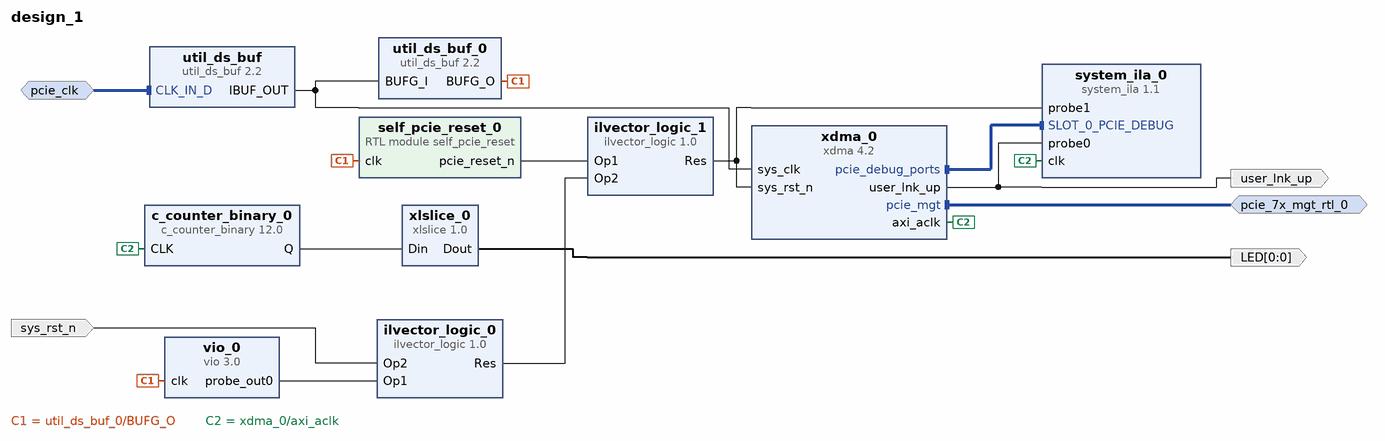
[diagram p0: block diagram of the top level]
# Vivado block design design_1, xc7a200tfbg484-2, Vivado 2025.2
create_bd_design design_1

create_bd_intf_port -mode Master -vlnv xilinx.com:interface:pcie_7x_mgt_rtl:1.0 pcie_7x_mgt_rtl_0
create_bd_intf_port -mode Slave -vlnv xilinx.com:interface:diff_clock_rtl:1.0 pcie_clk
set_property -dict {CONFIG.FREQ_HZ 100000000} [get_bd_intf_ports pcie_clk]
create_bd_port -dir I -type rst sys_rst_n
set_property -dict {CONFIG.POLARITY ACTIVE_LOW} [get_bd_ports sys_rst_n]
create_bd_port -dir O -from 0 -to 0 LED
create_bd_port -dir O user_lnk_up

create_bd_cell -type ip -vlnv xilinx.com:ip:xdma:4.2 xdma_0
set_property -dict [list \
  CONFIG.axi_data_width 64_bit \
  CONFIG.axilite_master_en false \
  CONFIG.axisten_freq 125 \
  CONFIG.enable_ltssm_dbg true \
  CONFIG.enable_mark_debug true \
  CONFIG.enable_pcie_debug_ports True \
  CONFIG.mode_selection Advanced \
  CONFIG.pcie_blk_locn X0Y0 \
  CONFIG.pf0_device_id 7022 \
  CONFIG.pl_link_cap_max_link_speed 5.0_GT/s \
  CONFIG.pl_link_cap_max_link_width X2 \
  CONFIG.ref_clk_freq 100_MHz \
  CONFIG.vendor_id 10EE \
  CONFIG.xdma_axi_intf_mm AXI_Memory_Mapped \
  CONFIG.xdma_num_usr_irq 1 \
  CONFIG.xdma_rnum_chnl 1 \
  CONFIG.xdma_wnum_chnl 1 \
] [get_bd_cells xdma_0]
create_bd_cell -type ip -vlnv xilinx.com:ip:util_ds_buf:2.2 util_ds_buf
set_property -dict {CONFIG.C_BUF_TYPE IBUFDSGTE} [get_bd_cells util_ds_buf]
create_bd_cell -type ip -vlnv xilinx.com:ip:c_counter_binary:12.0 c_counter_binary_0
set_property -dict {CONFIG.Output_Width 26} [get_bd_cells c_counter_binary_0]
create_bd_cell -type ip -vlnv xilinx.com:ip:xlslice:1.0 xlslice_0
set_property -dict {CONFIG.DIN_FROM 25 CONFIG.DIN_TO 25 CONFIG.DIN_WIDTH 26} [get_bd_cells xlslice_0]
create_bd_cell -type ip -vlnv xilinx.com:ip:system_ila:1.1 system_ila_0
set_property -dict [list \
  CONFIG.ALL_PROBE_SAME_MU_CNT 1 \
  CONFIG.C_DATA_DEPTH 8192 \
  CONFIG.C_MON_TYPE MIX \
  CONFIG.C_NUM_MONITOR_SLOTS 1 \
  CONFIG.C_NUM_OF_PROBES 2 \
  CONFIG.C_PROBE_WIDTH_PROPAGATION AUTO \
  CONFIG.C_SLOT_0_INTF_TYPE xilinx.com:display_xdma:pcie_debug_rtl:1.0 \
] [get_bd_cells system_ila_0]
create_bd_cell -type ip -vlnv xilinx.com:ip:vio:3.0 vio_0
set_property -dict {CONFIG.C_NUM_PROBE_IN 0 CONFIG.C_PROBE_OUT0_INIT_VAL 0001} [get_bd_cells vio_0]
create_bd_cell -type inline_hdl -vlnv xilinx.com:inline_hdl:ilvector_logic:1.0 ilvector_logic_0
set_property -dict {CONFIG.C_SIZE 1} [get_bd_cells ilvector_logic_0]
create_bd_cell -type ip -vlnv xilinx.com:ip:util_ds_buf:2.2 util_ds_buf_0
set_property -dict {CONFIG.C_BUF_TYPE BUFG} [get_bd_cells util_ds_buf_0]
create_bd_cell -type module -reference self_pcie_reset self_pcie_reset_0
create_bd_cell -type inline_hdl -vlnv xilinx.com:inline_hdl:ilvector_logic:1.0 ilvector_logic_1
set_property -dict {CONFIG.C_SIZE 1} [get_bd_cells ilvector_logic_1]

# ---- connections ----

connect_bd_intf_net [get_bd_intf_pins xdma_0/pcie_debug_ports] [get_bd_intf_pins system_ila_0/SLOT_0_PCIE_DEBUG]
connect_bd_intf_net [get_bd_intf_ports pcie_clk] [get_bd_intf_pins util_ds_buf/CLK_IN_D]
connect_bd_intf_net [get_bd_intf_ports pcie_7x_mgt_rtl_0] [get_bd_intf_pins xdma_0/pcie_mgt]
connect_bd_net [get_bd_pins c_counter_binary_0/Q] [get_bd_pins xlslice_0/Din]
connect_bd_net -net ilvector_logic_0_Res [get_bd_pins ilvector_logic_1/Res] [get_bd_pins xdma_0/sys_rst_n] [get_bd_pins system_ila_0/probe1]
connect_bd_net [get_bd_pins ilvector_logic_0/Res] [get_bd_pins ilvector_logic_1/Op2]
connect_bd_net [get_bd_pins self_pcie_reset_0/pcie_reset_n] [get_bd_pins ilvector_logic_1/Op1]
connect_bd_net [get_bd_ports sys_rst_n] [get_bd_pins ilvector_logic_0/Op2]
connect_bd_net [get_bd_pins util_ds_buf_0/BUFG_O] [get_bd_pins vio_0/clk] [get_bd_pins self_pcie_reset_0/clk]
connect_bd_net [get_bd_pins util_ds_buf/IBUF_OUT] [get_bd_pins xdma_0/sys_clk] [get_bd_pins util_ds_buf_0/BUFG_I]
connect_bd_net [get_bd_pins vio_0/probe_out0] [get_bd_pins ilvector_logic_0/Op1]
connect_bd_net [get_bd_pins xdma_0/axi_aclk] [get_bd_pins c_counter_binary_0/CLK] [get_bd_pins system_ila_0/clk]
connect_bd_net [get_bd_pins xdma_0/user_lnk_up] [get_bd_ports user_lnk_up] [get_bd_pins system_ila_0/probe0]
connect_bd_net [get_bd_pins xlslice_0/Dout] [get_bd_ports LED]

validate_bd_design
save_bd_design
